# Altium schematic sheet BLOCK DIAGRAM.SchDoc
size A3; Organization: Altium Limited; Address1: L3, 12a Rodborough Rd; Address2: Frenchs Forest; Address3: NSW; Address4: Australia 2086; DocumentNumber: 1; SheetNumber: 1; SheetTotal: 5
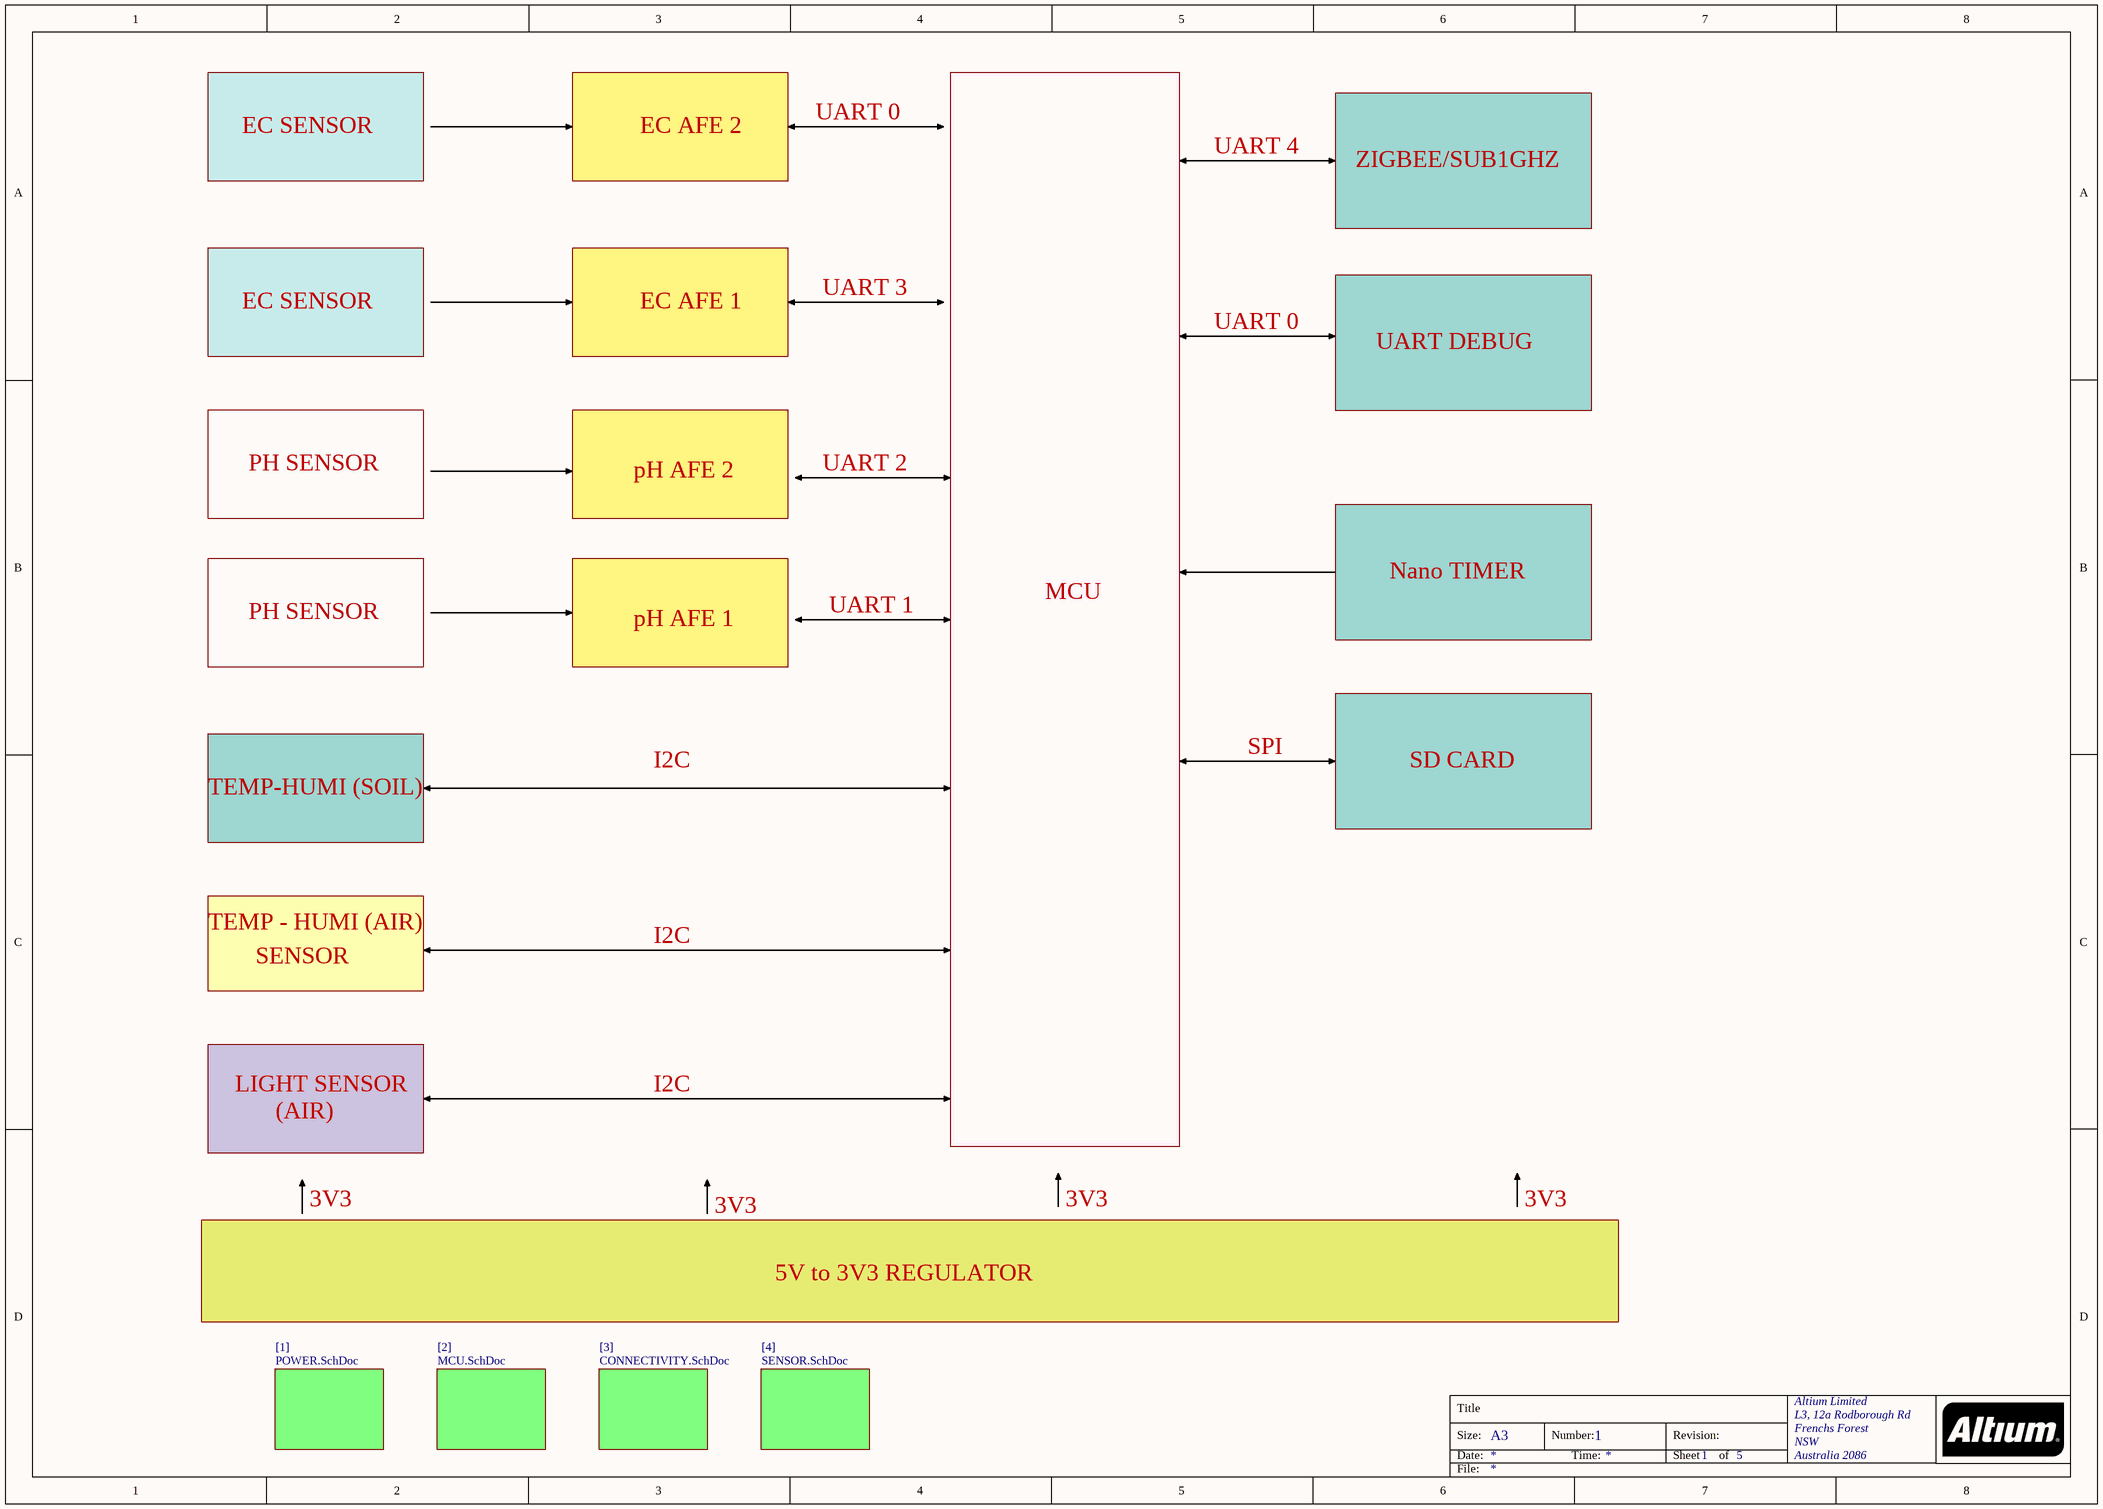
[diagram p0: BLOCK DIAGRAM.SchDoc]

## Sub-sheets
[1] = POWER.SchDoc: no entries
[2] = MCU.SchDoc: no entries
[3] = CONNECTIVITY.SchDoc: no entries
[4] = SENSOR.SchDoc: no entries

## Notes on the sheet
- EC SENSOR
- EC AFE 2
- UART 0
- UART 4
- ZIGBEE/SUB1GHZ
- EC AFE 1
- UART 3
- UART DEBUG
- PH SENSOR
- pH AFE 2
- UART 2
- Nano TIMER
- pH AFE 1
- UART 1
- MCU
- I2C
- SPI
- SD CARD
- TEMP-HUMI (SOIL)
- TEMP - HUMI (AIR)
- SENSOR
- LIGHT SENSOR
- (AIR)
- 3V3
- 5V to 3V3 REGULATOR
- Title
- Size:
- Date:
- A3
- Number:
- Time:
- Revision:
- Sheet
- of
- File: